# EAGLE design core (EAGLE 6.4)
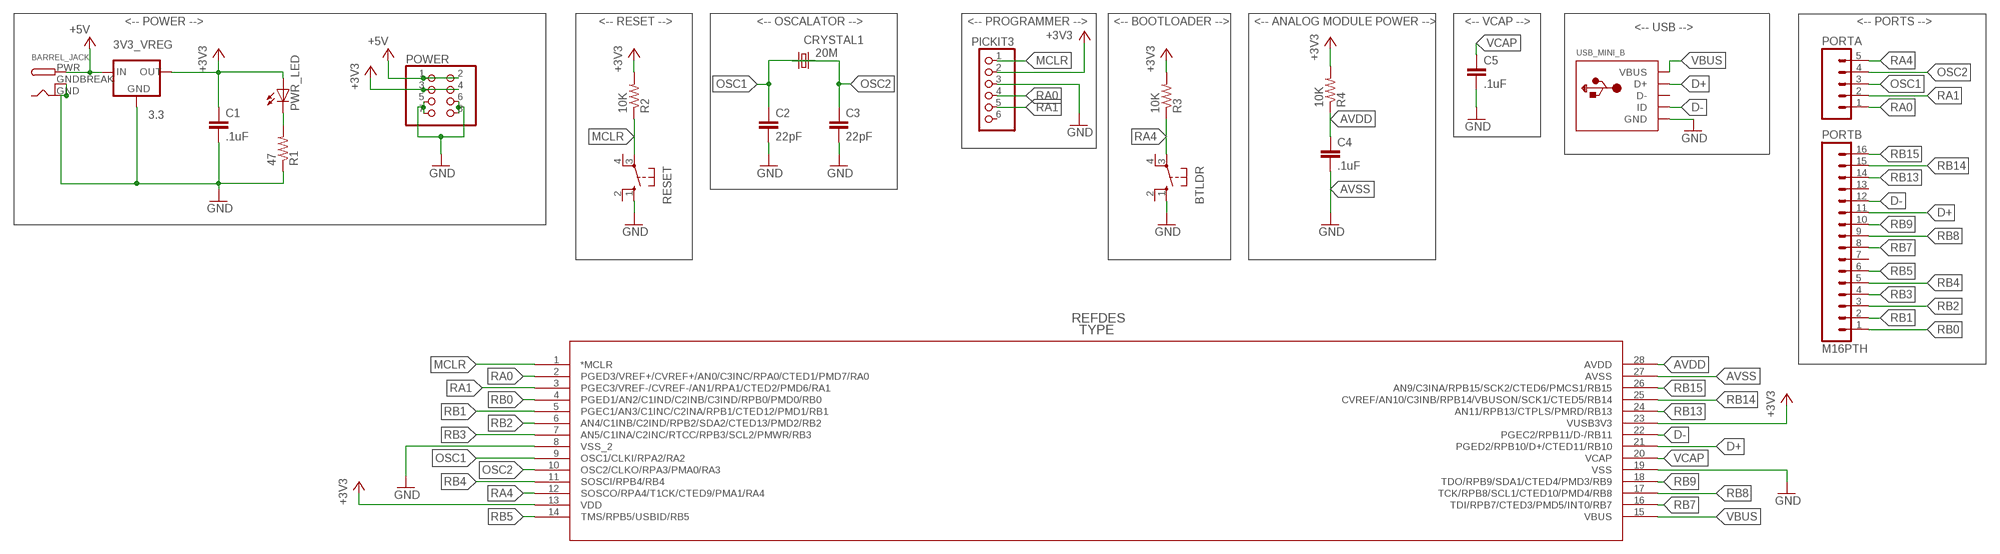
[diagram p0: schematic, sheet 1]

## Parts
3V3_VREG  3.3  V_REG_78XX-TO-220  [TO-220-ALT]
BARREL_JACK  DCBARRELPTH  [DCJACK_2MM_PTH]
BTLDR  10-XX  [B3F-10XX]
C1  .1uF  C2.5/2  [C2.5-2]
C2  22pF  C2.5/2  [C2.5-2]
C3  22pF  C2.5/2  [C2.5-2]
C4  .1uF  C2.5/2  [C2.5-2]
C5  .1uF  C2.5/2  [C2.5-2]
CRYSTAL1  20M  CRYSTALHC49U-V  [HC49U-V]
PICKIT3  PINHD-1X6  [1X06]
PORTA  M05PTH  [1X05]
PORTB  M16PTH  [1X16]
POWER  PINHD-2X4  [2X04]
PWR_LED  LED5MM  [LED5MM]
R1  47  R-US_0207/10  [0207/10]
R2  10K  R-US_0207/10  [0207/10]
R3  10K  R-US_0207/10  [0207/10]
R4  10K  R-US_0207/10  [0207/10]
RESET  10-XX  [B3F-10XX]
U1  PIC32MX230F064B-  [SPDIP28_300MC]
USB_MINI_B  USBMOLEX  [USB-MINIB-THM-MOLEX]

## Nets
+3V3: 3V3_VREG.OUT C1.1 PICKIT3.2 POWER.3 POWER.4 PWR_LED.A R2.2 R3.2 R4.2 U1.13(VDD) U1.23(VUSB3V3)
+5V: 3V3_VREG.IN BARREL_JACK.PWR POWER.1 POWER.2
AVDD: C4.1 R4.1 U1.28(AVDD)
AVSS: C4.2 U1.27(AVSS) ; supply symbol labelled GND
D+: PORTB.11 U1.21(PGED2/RPB10/D+/CTED11/RB10) USB_MINI_B.D+
D-: PORTB.12 U1.22(PGEC2/RPB11/D-/RB11) USB_MINI_B.ID
GND: 3V3_VREG.GND BARREL_JACK.GND BARREL_JACK.GNDBREAK BTLDR.1(S) C1.2 C2.2 C3.2 C5.2 PICKIT3.3 POWER.5 POWER.6 POWER.7 POWER.8 R1.1 RESET.1(S) U1.8(VSS_2) U1.19(VSS) USB_MINI_B.GND
MCLR: PICKIT3.1 R2.1 RESET.3(P) U1.1(*MCLR)
N$5: PWR_LED.K(C) R1.2
OSC1: C2.1 CRYSTAL1.2 PORTA.3 U1.9(OSC1/CLKI/RPA2/RA2)
OSC2: C3.1 CRYSTAL1.1 PORTA.4 U1.10(OSC2/CLKO/RPA3/PMA0/RA3)
RA0: PICKIT3.4 PORTA.1 U1.2(PGED3/VREF+/CVREF+/AN0/C3INC/RPA0/CTED1/PMD7/RA0)
RA1: PICKIT3.5 PORTA.2 U1.3(PGEC3/VREF-/CVREF-/AN1/RPA1/CTED2/PMD6/RA1)
RA4: BTLDR.3(P) PORTA.5 R3.1 U1.12(SOSCO/RPA4/T1CK/CTED9/PMA1/RA4)
RB0: PORTB.1 U1.4(PGED1/AN2/C1IND/C2INB/C3IND/RPB0/PMD0/RB0)
RB1: PORTB.2 U1.5(PGEC1/AN3/C1INC/C2INA/RPB1/CTED12/PMD1/RB1)
RB2: PORTB.3 U1.6(AN4/C1INB/C2IND/RPB2/SDA2/CTED13/PMD2/RB2)
RB3: PORTB.4 U1.7(AN5/C1INA/C2INC/RTCC/RPB3/SCL2/PMWR/RB3)
RB4: PORTB.5 U1.11(SOSCI/RPB4/RB4)
RB5: PORTB.6 U1.14(TMS/RPB5/USBID/RB5)
RB7: PORTB.8 U1.16(TDI/RPB7/CTED3/PMD5/INT0/RB7)
RB8: PORTB.9 U1.17(TCK/RPB8/SCL1/CTED10/PMD4/RB8)
RB9: PORTB.10 U1.18(TDO/RPB9/SDA1/CTED4/PMD3/RB9)
RB13: PORTB.14 U1.24(AN11/RPB13/CTPLS/PMRD/RB13)
RB14: PORTB.15 U1.25(CVREF/AN10/C3INB/RPB14/VBUSON/SCK1/CTED5/RB14)
RB15: PORTB.16 U1.26(AN9/C3INA/RPB15/SCK2/CTED6/PMCS1/RB15)
VBUS: U1.15(VBUS) USB_MINI_B.VBUS
VCAP: C5.1 U1.20(VCAP)
Unconnected: BTLDR.2(S1) BTLDR.4(P1) PICKIT3.6 PORTB.7 PORTB.13 RESET.2(S1) RESET.4(P1) USB_MINI_B.D-

## Notes on the sheet
- <-- POWER --> | <-- RESET --> | <-- OSCALATOR --> | <-- PROGRAMMER --> | <-- BOOTLOADER --> | <-- ANALOG MODULE POWER --> | <-- VCAP --> | <-- PORTS -->
- <-- USB -->

## Library data of the parts
3V3_VREG = SparkFun-PowerIC:V_REG_78XX: Voltage Regulator Standard 7805 5V regulator. IGO (Input Ground Output). Spark Fun Electronics SKU : COM-00107
BARREL_JACK = adafruit:DCBARREL: 2.0mm DC Barrel Jack DCJACK_2MM_PTH - Through Hole Jack (4UConnector: 05537)
BTLDR RESET = switch-omron:10-XX: OMRON SWITCH; MPN: B3F-1000; OC_FARNELL: 176432; OC_NEWARK: 36M3542
C1-C5 = capacitor-wima:C: CAPACITOR naming: grid - package width
CRYSTAL1 = crystal:CRYSTAL: CRYSTAL; OC_FARNELL: 1666969; OC_NEWARK: unknown
PICKIT3 = adafruit:PINHD-1X6: PIN HEADER
PORTA = SparkFun-Connectors:M05: Header 5 Standard 5-pin 0.1" header. Use with straight break away headers (SKU : PRT-00116), right angle break away headers (PRT-00553), swiss pins (PRT-00743), machine pins (PRT-00117), and female headers (PRT-00115). Molex polarized connector foot print use with SKU : PRT-08230 with associated crimp pins and housings.
PORTB = SparkFun-Connectors:M16: 1x16 .1" header
POWER = adafruit:PINHD-2X4: PIN HEADER
PWR_LED = adafruit:LED: LED OSRAM: - CHIPLED LG R971, LG N971, LY N971, LG Q971, LY Q971, LO R971, LY R971 LH N974, LH R974 LS Q976, LO Q976, LY Q976 LO Q996 - Hyper CHIPLED LW Q18S LB Q993, LB Q99A, LB R99A - SideLED LS A670, LO A670, LY A670, LG A670, LP A670 LB A673, LV A673, LT A673, LW A673 LH A674 LY A675 LS A676, LA A676, LO A676, LY A676, LW A676 LS A679, LY A679, LG A679 - Hyper Micro SIDELED® LS Y876, LA Y876, LO Y876, LY Y876 LT Y87S - SmartLED LW L88C, LW L88S LB L89C, LB L89S, LG L890 LS L89K, LO L89K, LY L89K LS L896, LA L896, LO L896, LY L896 - TOPLED LS T670, LO T670, LY T670, LG T670, LP T670 LSG T670, LSP T670, LSY T670, LOP T670, LYG T670 LG T671, LOG T671, LSG T671 LB T673, LV T673, LT T673, LW T673 LH T674 LS T676, LA T676, LO T676, LY T676, LB T676, LH T676, LSB T676, LW T676 LB T67C, LV T67C, LT T67C, LS T67K, LO T67K, LY T67K, LW E67C LS E67B, LA E67B, LO E67B, LY E67B, LB E67C, LV E67C, LT E67C LW T67C LS T679, LY T679, LG T679 LS T770, LO T770, LY T770, LG T770, LP T770 LB T773, LV T773, LT T773, LW T773 LH T774 LS E675, LA E675, LY E675, LS T675 LS T776, LA T776, LO T776, LY T776, LB T776 LHGB T686 LT T68C, LB T68C - Hyper Mini TOPLED® LB M676 - Mini TOPLED Santana® LG M470 LS M47K, LO M47K, LY M47K Source: http://www.osram.convergy.de/
R1-R4 = resistor:R-US_: RESISTOR, American symbol
U1 = uSensor:PIC32MX230F064B-
USB_MINI_B = adafruit:USB: USB Connectors USBMINIB - Surface Mount Female Mini-B USB Connector 4UConnector: 06564 By microbuilder.eu Thru-hole RA Female Mini-B USB Connector 4UConnector: 18732 By ladyada.net

## Board
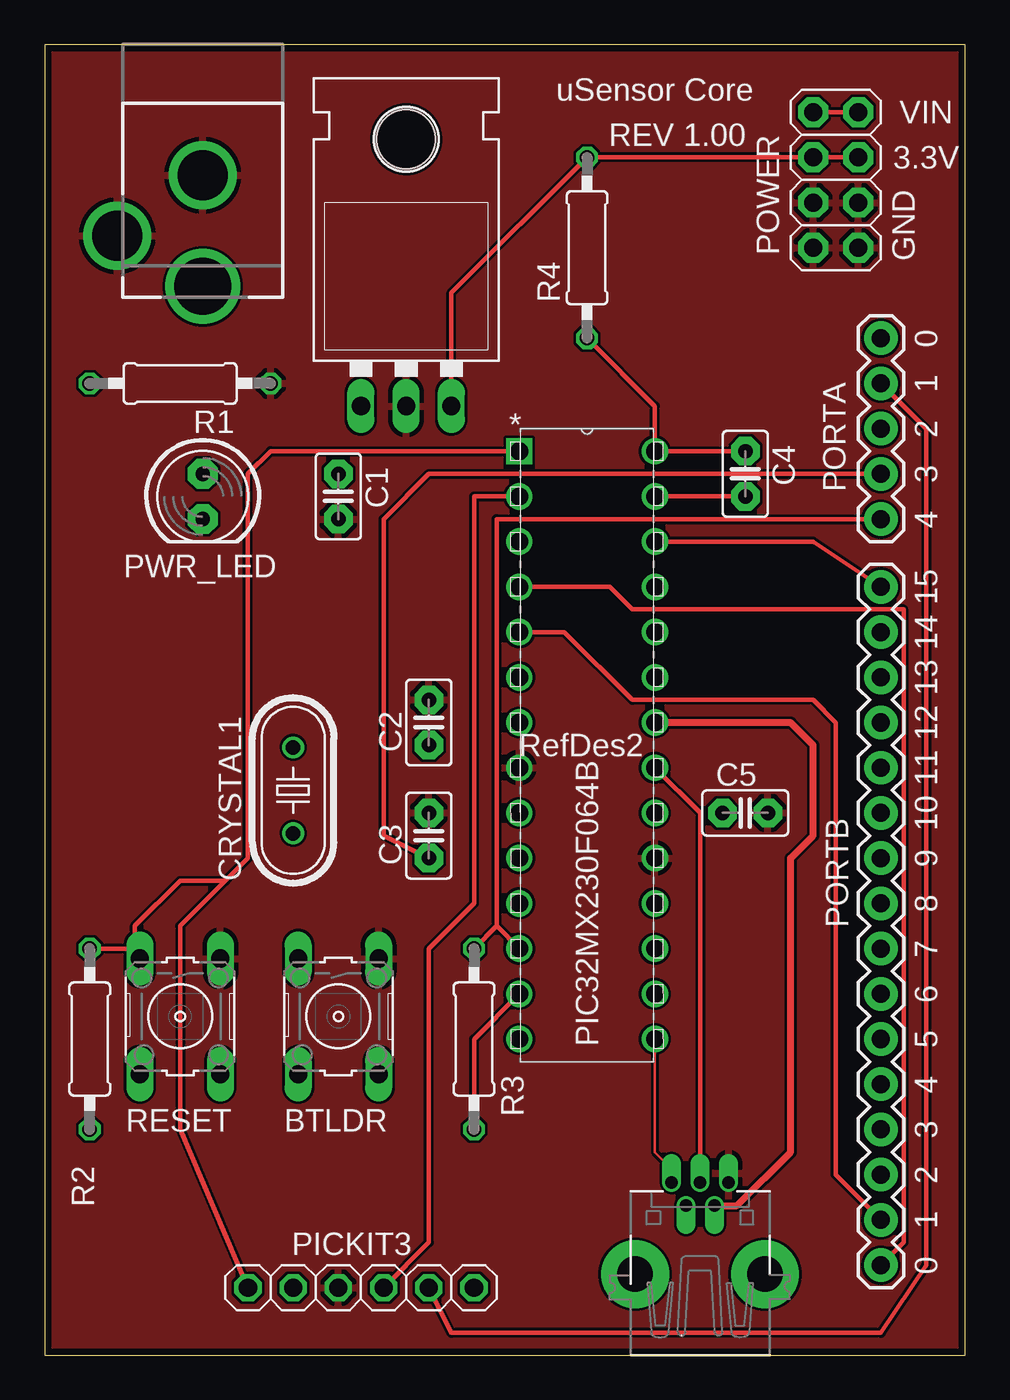
[diagram p1: board, top side]
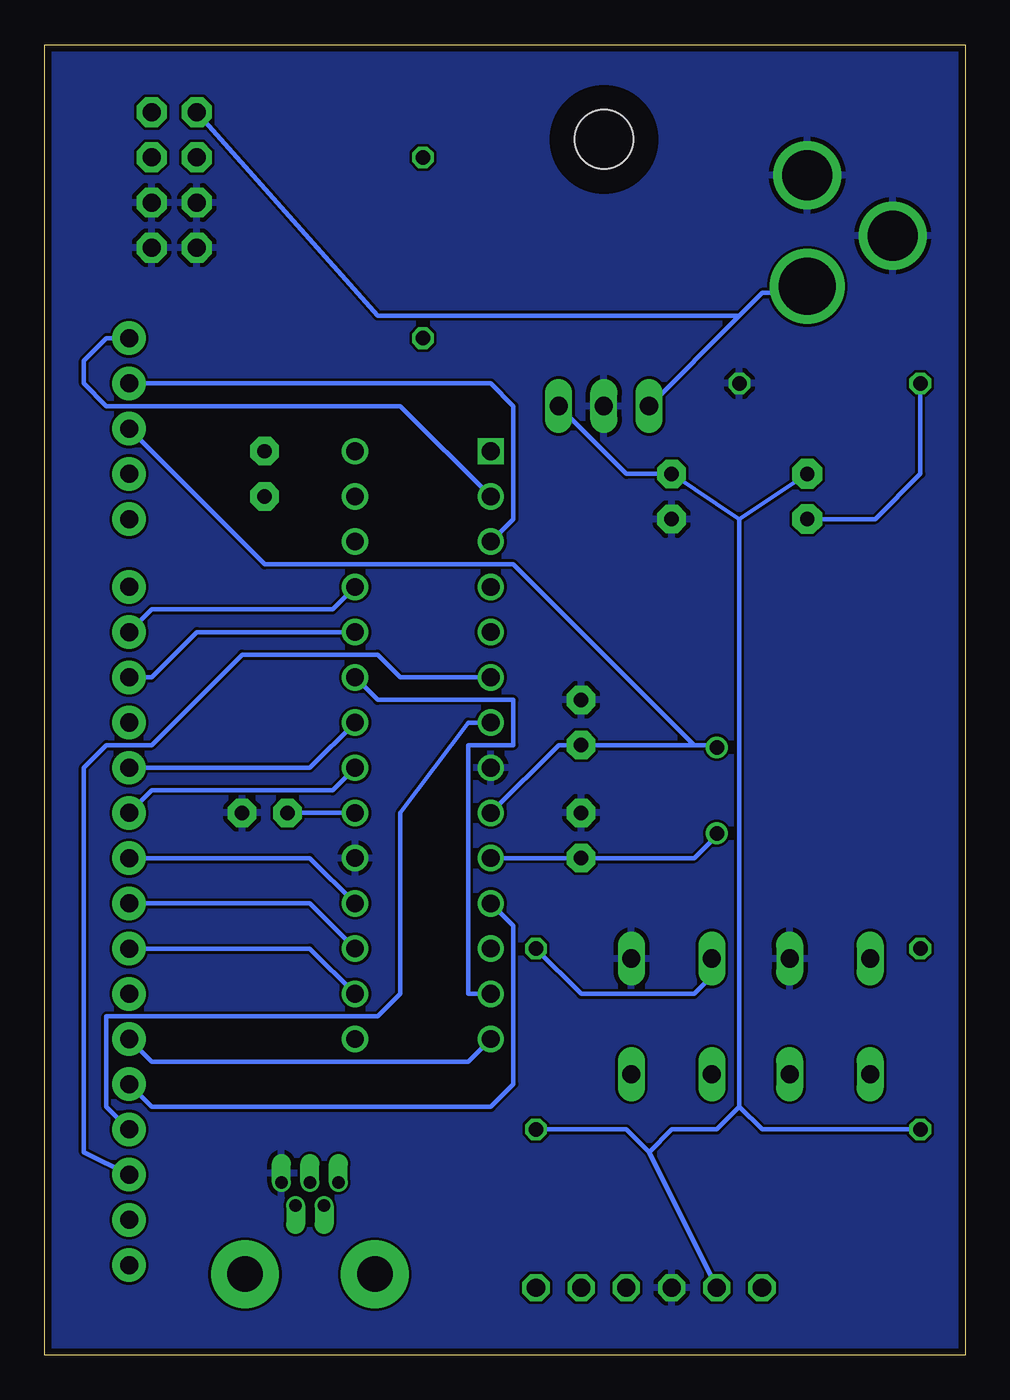
[diagram p2: board, bottom side, seen from below]

Size 51.74 x 73.65 mm. Coordinates in mm from the lower left corner, seen from the top.
Outline: 0,0 51.74,0 51.74,73.65 0,73.65 0,0
Copper layers (1*16): Top 0.0356mm / dielectric 1.5011mm / Bottom 0.0356mm
Design rules "OSHPark": minimum track width 6mil, minimum drill 13mil, track to track 6mil, track to pad 6mil, pad to pad 6mil, via to via 6mil, smd to smd 6mil, copper to edge 15mil, drill to drill 6mil, minimum pad ring 7mil, minimum via ring 7mil, stop-mask expansion 4mil, vias tented up to drill 0mil, thermal gap 10mil

### Footprints (pad centres in the part's own frame; a part is rotated, then mirrored left to right if it is on the bottom)
TO-220-ALT = drill 1.016 long: GND 0,-3.81; IN -2.54,-3.81; OUT 2.54,-3.81 | hole 3.302: 0,11.176
DCJACK_2MM_PTH = drill 2.8: GND 0,7.35; GNDBREAK 4.8,10.75 | drill 3.2: PWR 0,13.6
B3F-10XX = drill 1.016 long: 1 -3.251,2.261; 2 3.251,2.261; 3 -3.251,-2.261; 4 3.251,-2.261
C2.5-2 = drill 0.813 pad 1.6 octagon: 1 -1.27,0; 2 1.27,0
HC49U-V = drill 0.813: 1 -2.413,0; 2 2.413,0
1X06 = drill 1.016 octagon: 1 -6.35,0; 2 -3.81,0; 3 -1.27,0; 4 1.27,0; 5 3.81,0; 6 6.35,0
1X05 = drill 1.016 pad 1.88: 1 0,0; 2 2.54,0; 3 5.08,0; 4 7.62,0; 5 10.16,0
1X16 = drill 1.016 pad 1.88: 1 0,0; 2 2.54,0; 3 5.08,0; 4 7.62,0; 5 10.16,0; 6 12.7,0; 7 15.24,0; 8 17.78,0; 9 20.32,0; 10 22.86,0; 11 25.4,0; 12 27.94,0; 13 30.48,0; 14 33.02,0; 15 35.56,0; 16 38.1,0
2X04 = drill 1.016 pad 1.676 octagon: 1 -3.81,-1.27; 2 -3.81,1.27; 3 -1.27,-1.27; 4 -1.27,1.27; 5 1.27,-1.27; 6 1.27,1.27; 7 3.81,-1.27; 8 3.81,1.27
LED5MM = drill 0.813 pad 1.676 octagon: A -1.27,0; K 1.27,0
0207/10 = drill 0.813 octagon: 1 -5.08,0; 2 5.08,0
SPDIP28_300MC = drill 0.991 square: 1 -7.62,33.02 | drill 0.991: 2 -7.62,30.48; 3 -7.62,27.94; 4 -7.62,25.4; 5 -7.62,22.86; 6 -7.62,20.32; 7 -7.62,17.78; 8 -7.62,15.24; 9 -7.62,12.7; 10 -7.62,10.16; 11 -7.62,7.62; 12 -7.62,5.08; 13 -7.62,2.54; 14 -7.62,0; 15 0,0; 16 0,2.54; 17 0,5.08; 18 0,7.62; 19 0,10.16; 20 0,12.7; 21 0,15.24; 22 0,17.78; 23 0,20.32; 24 0,22.86; 25 0,25.4; 26 0,27.94; 27 0,30.48; 28 0,33.02
USB-MINIB-THM-MOLEX = drill 0.7 offset: D+ 0,9.72; D- -0.8,8.42; GND 1.6,9.72; ID 0.8,8.42; VBUS -1.6,9.72 | drill 2 pad 3.81: GND1 -3.65,4.57; GND4 3.65,4.57

### Placement (x,y rotation side)
3V3_VREG  20.32,57.15 0 top
BARREL_JACK  8.89,73.66 180 top
BTLDR  16.51,19.05 270 top
C1  16.51,48.26 270 top
C2  21.59,35.56 90 top
C3  21.59,29.21 90 top
C4  39.37,49.53 270 top
C5  39.37,30.48 0 top
CRYSTAL1  13.97,31.75 90 top
PICKIT3  17.78,3.81 0 top
PORTA  46.99,57.15 270 top
PORTB  46.99,5.08 90 top
POWER  44.45,66.04 270 top
PWR_LED  8.89,48.26 270 top
R1  7.62,54.61 180 top
R2  2.54,17.78 270 top
R3  24.13,17.78 270 top
R4  30.48,62.23 90 top
RESET  7.62,19.05 270 top
U1  34.29,17.78 0 top
USB_MINI_B  36.83,0 0 top

### Tracks (layer width: path | path; a pad name or v marks a point on that pad's centre or on a via)
+3V3
  Top 0.254: POWER.4 POWER.3 R4.2 22.86,59.69 3V3_VREG.OUT | U1.13 24.13,17.78 R3.2
  Bottom 0.254: 3V3_VREG.OUT 19.05,49.53 C1.1 12.7,46.99 | 12.7,46.99 PWR_LED.A | R3.2 19.05,12.7 17.78,11.43 | 17.78,11.43 16.51,12.7 13.97,12.7 12.7,13.97 | 12.7,13.97 11.43,12.7 R2.2 | U1.23 33.02,36.83 25.4,36.83 25.4,34.29 27.94,34.29 27.94,20.32 U1.13 | 17.78,11.43 PICKIT3.2 | 12.7,13.97 12.7,46.99
+5V
  Top 0.254: POWER.2 POWER.1
  Bottom 0.254: 12.7,58.42 11.43,59.69 7.62,59.69 BARREL_JACK.PWR | 12.7,58.42 3V3_VREG.IN | POWER.1 33.02,58.42 12.7,58.42
AVDD
  Top 0.254: R4.1 34.29,53.34 U1.28 C4.1
AVSS
  Top 0.254: C4.2 U1.27
D+
  Top 0.254: USB_MINI_B.D+ 36.83,30.48 U1.21
  Bottom 0.254: PORTB.11 45.72,31.75 35.56,31.75 U1.21
D-
  Top 0.406: USB_MINI_B.ID 38.9,8.42 41.91,11.43 41.91,27.94 43.18,29.21 43.18,34.29 41.91,35.56 U1.22
  Bottom 0.254: PORTB.12 36.83,33.02 U1.22
GND
  pour Top: -6.35,97.79 -6.35,-26.67 115.57,-26.67 115.57,97.79
  pour Bottom: -5.08,76.2 54.61,76.2 54.61,-6.35 -5.08,-6.35
MCLR
  Top 0.254: 5.08,22.86 R2.1 | U1.1 12.7,50.8 11.43,49.53 11.43,27.94 10.16,26.67 | 5.08,22.86 5.08,24.13 7.62,26.67 10.16,26.67 | 5.08,22.86 RESET.3 | PICKIT3.1 7.62,12.7 7.62,24.13 10.16,26.67
N$5
  Bottom 0.254: R1.2 2.54,49.53 5.08,46.99 PWR_LED.K
OSC1
  Bottom 0.254: 15.24,34.29 C2.1 22.86,34.29 U1.9 | 15.24,34.29 13.97,34.29 CRYSTAL1.2 | PORTA.3 39.37,44.45 25.4,44.45 15.24,34.29
OSC2
  Top 0.254: PORTA.4 21.59,49.53 19.05,46.99 19.05,29.21 C3.1
  Bottom 0.254: CRYSTAL1.1 13.97,29.21 15.24,27.94 C3.1 U1.10
RA0
  Top 0.254: U1.2 24.13,48.26 24.13,25.4 21.59,22.86 21.59,6.35 PICKIT3.4
  Bottom 0.254: PORTA.1 48.26,57.15 49.53,55.88 49.53,54.61 48.26,53.34 31.75,53.34 U1.2
RA1
  Top 0.254: PICKIT3.5 22.86,1.27 46.99,1.27 49.53,5.08 49.53,52.07 PORTA.2
  Bottom 0.254: U1.3 25.4,46.99 25.4,53.34 26.67,54.61 PORTA.2
RA4
  Top 0.254: U1.12 25.4,24.13 | 25.4,24.13 R3.1 | PORTA.5 25.4,46.99 25.4,24.13
  Bottom 0.254: R3.1 21.59,20.32 15.24,20.32 13.97,21.59 BTLDR.3
RB0
  Top 0.254: U1.4 31.75,43.18 33.02,41.91 48.26,41.91 48.26,6.35 PORTB.1
RB1
  Top 0.254: U1.5 29.21,40.64 33.02,36.83 43.18,36.83 44.45,35.56 44.45,10.16 PORTB.2
RB2
  Bottom 0.254: U1.6 31.75,38.1 33.02,39.37 40.64,39.37 45.72,34.29 48.26,34.29 49.53,33.02 49.53,11.43 PORTB.3
RB3
  Bottom 0.254: U1.7 27.94,35.56 31.75,30.48 31.75,20.32 33.02,19.05 48.26,19.05 48.26,13.97 PORTB.4
RB4
  Bottom 0.254: U1.11 25.4,24.13 25.4,15.24 26.67,13.97 45.72,13.97 PORTB.5
RB5
  Bottom 0.254: U1.14 27.94,16.51 45.72,16.51 PORTB.6
RB7
  Bottom 0.254: U1.16 36.83,22.86 PORTB.8
RB8
  Bottom 0.254: U1.17 36.83,25.4 PORTB.9
RB9
  Bottom 0.254: U1.18 36.83,27.94 PORTB.10
RB13
  Bottom 0.254: U1.24 43.18,40.64 45.72,38.1 PORTB.14
RB14
  Bottom 0.254: U1.25 35.56,41.91 45.72,41.91 PORTB.15
RB15
  Top 0.254: U1.26 43.18,45.72 PORTB.16
VBUS
  Top 0.152: U1.15 34.29,11.43 35.56,10.16 USB_MINI_B.VBUS
VCAP
  Bottom 0.254: C5.1 U1.20

### Text on the board
tNames: uSensor Core | VIN | REV 1.00 | 3.3V | GND | 0 | 1 | 2 | 3 | 4 | 15 | 14 | 13 | 12 | 11 | 10 | 9 | PIC32MX230F064B | 8 | 7 | 6 | 5 | 4 | 3 | 2 | 1 | 0